# EAGLE design Buttons (EAGLE 9.6.2)
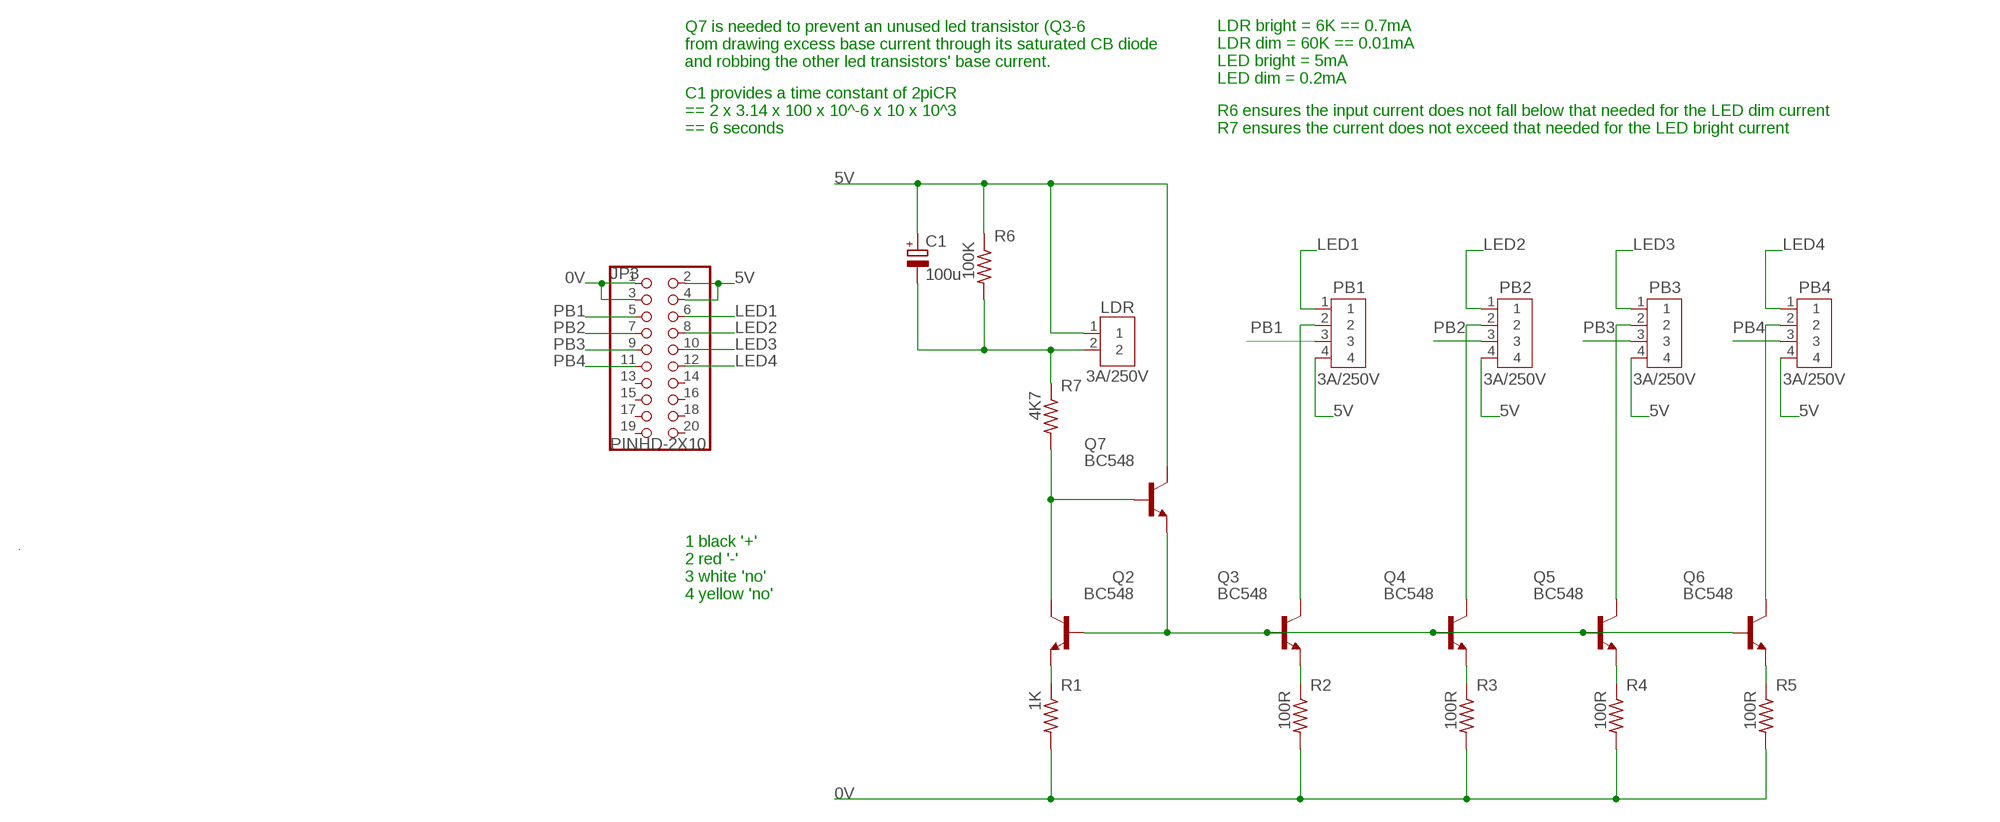
[diagram p0: schematic, sheet 1]

## Parts
C1  100u  CPOL-EUE3.5-8  [E3,5-8]
JP3  PINHD-2X10  [2X10]
LDR  3A/250V  B2B-XH-A  [B2B-XH-A]
PB1  3A/250V  B4B-XH-A  [B4B-XH-A]
PB2  3A/250V  B4B-XH-A  [B4B-XH-A]
PB3  3A/250V  B4B-XH-A  [B4B-XH-A]
PB4  3A/250V  B4B-XH-A  [B4B-XH-A]
Q2  BC548  [TO92-EBC]
Q3  BC548  [TO92-EBC]
Q4  BC548  [TO92-EBC]
Q5  BC548  [TO92-EBC]
Q6  BC548  [TO92-EBC]
Q7  BC548  [TO92-EBC]
R1  1K  RES_7  [0204/7]
R2  100R  RES_7  [0204/7]
R3  100R  RES_7  [0204/7]
R4  100R  RES_7  [0204/7]
R5  100R  RES_7  [0204/7]
R6  100K  RES_7  [0204/7]
R7  4K7  RES_7  [0204/7]

## Nets
0V: JP3.1 JP3.3 R1.2 R2.2 R3.2 R4.2 R5.2
5V: C1.+ JP3.2 JP3.4 LDR.1 PB1.4 PB2.4 PB3.4 PB4.4 Q7.C R6.1
LED1: JP3.6 PB1.1
LED2: JP3.8 PB2.1
LED3: JP3.10 PB3.1
LED4: JP3.12 PB4.1
N$1: Q2.B Q3.B Q4.B Q5.B Q6.B Q7.E
N$2: C1.- LDR.2 R6.2 R7.1
N$3: Q2.C Q7.B R7.2
N$8: Q2.E R1.1
N$9: Q3.E R2.1
N$12: Q4.E R3.1
N$14: Q5.E R4.1
N$17: Q6.E R5.1
N$18: PB1.2 Q3.C
N$20: PB2.2 Q4.C
N$21: PB3.2 Q5.C
N$22: PB4.2 Q6.C
PB1: JP3.5 PB1.3
PB2: JP3.7 PB2.3
PB3: JP3.9 PB3.3
PB4: JP3.11 PB4.3
Unconnected: JP3.13 JP3.14 JP3.15 JP3.16 JP3.17 JP3.18 JP3.19 JP3.20

## Notes on the sheet
- Q7 is needed to prevent an unused led transistor (Q3-6
  from drawing excess base current through its saturated CB diode
  and robbing the other led transistors' base current.
- LDR bright = 6K == 0.7mA
  LDR dim = 60K == 0.01mA
  LED bright = 5mA
  LED dim = 0.2mA
- C1 provides a time constant of 2piCR
  == 2 x 3.14 x 100 x 10^-6 x 10 x 10^3
  == 6 seconds
- R6 ensures the input current does not fall below that needed for the LED dim current
  R7 ensures the current does not exceed that needed for the LED bright current
- 1 black '+'
  2 red '-'
  3 white 'no'
  4 yellow 'no'

## Library data of the parts
C1 = andrew-boyson:CPOL-EU: POLARIZED CAPACITOR, European symbol; SPICEPREFIX: C
JP3 = Connector:PINHD-2X10: PIN HEADER; CATEGORY: CONNECTOR; SUB-CATEGORY: PIN-HEADER
LDR = andrew-boyson:B2B-XH-A: XH Connector Top Entry - 2POS Details see: Datasheet <http://www.jst-mfg.com/product/pdf/eng/eXH.pdf>; CATEGORY: CONNECTOR; DESCRIPTION: 2.5mm pitch/disconnectable crimp style connector; MANUFACTURER: JST (XH CONNECTOR); MPN: B2B-XH-A; OPERATING_TEMPERATURE: -25°C ~ 85°C; PART_STATUS: ACTIVE; ROHS_COMPLIANT: COMPLIANT; SERIES: B_B-XH-A; SUB_CATEGORY: Through hole connector; TYPE: top entry
PB1-PB4 = andrew-boyson:B4B-XH-A: XH Connector Top Entry - 4POS Details see: Datasheet <http://www.jst-mfg.com/product/pdf/eng/eXH.pdf>; CATEGORY: CONNECTOR; DSECRIPTION: 2.5mm pitch/disconnctable crimp style connector; MANUFACTURER: JST (XH connector); MPN: B4B-XH-A; OPERATING_TEMPERATURE: -25 C to 85 C; PART_STATUS: ACTIVE; ROHS_COMPLIANT: COMPLAINT; SERIES: B4B-XH-A; SUB_CATEGORY: Through hole; TYPE: TOP ENTRY
Q2-Q7 = transistor-npn:BC548*: NPN Transistor
R1-R7 = andrew-boyson:RES_7: RESISTOR, American symbol

## Board
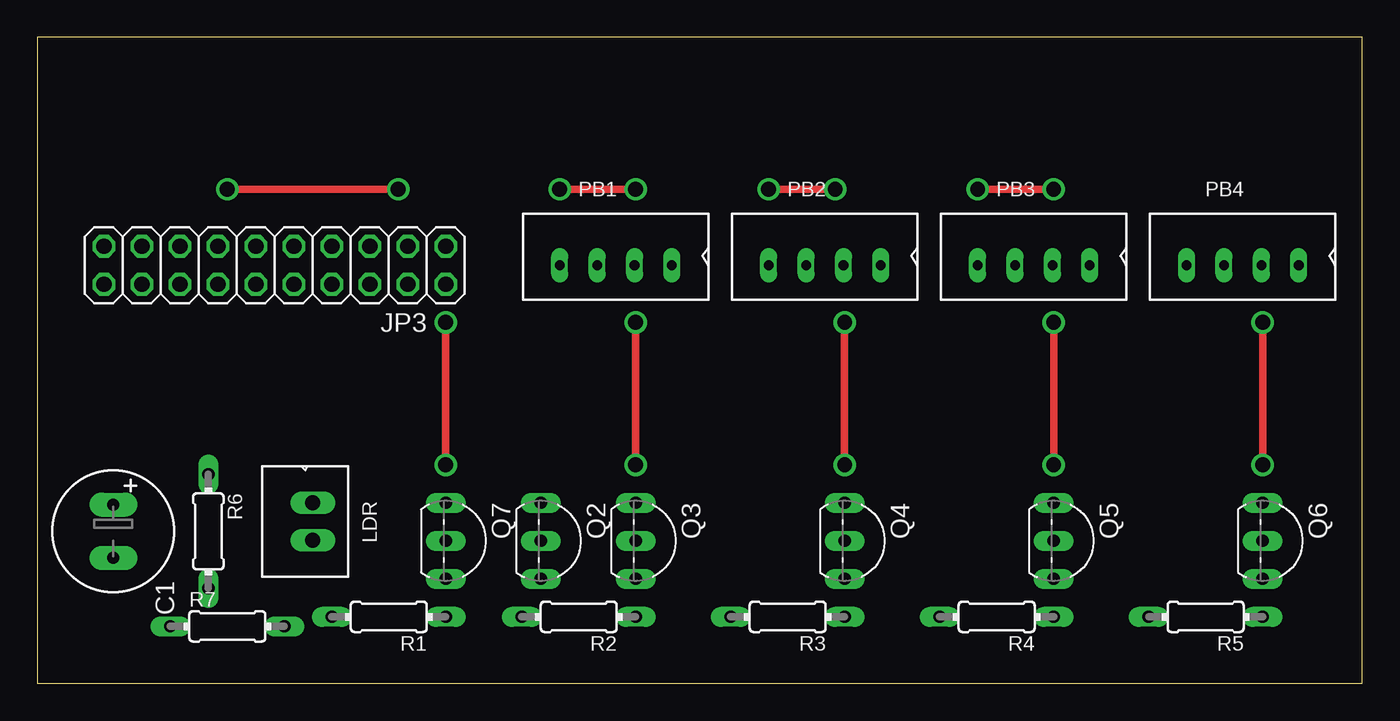
[diagram p1: board, top side]
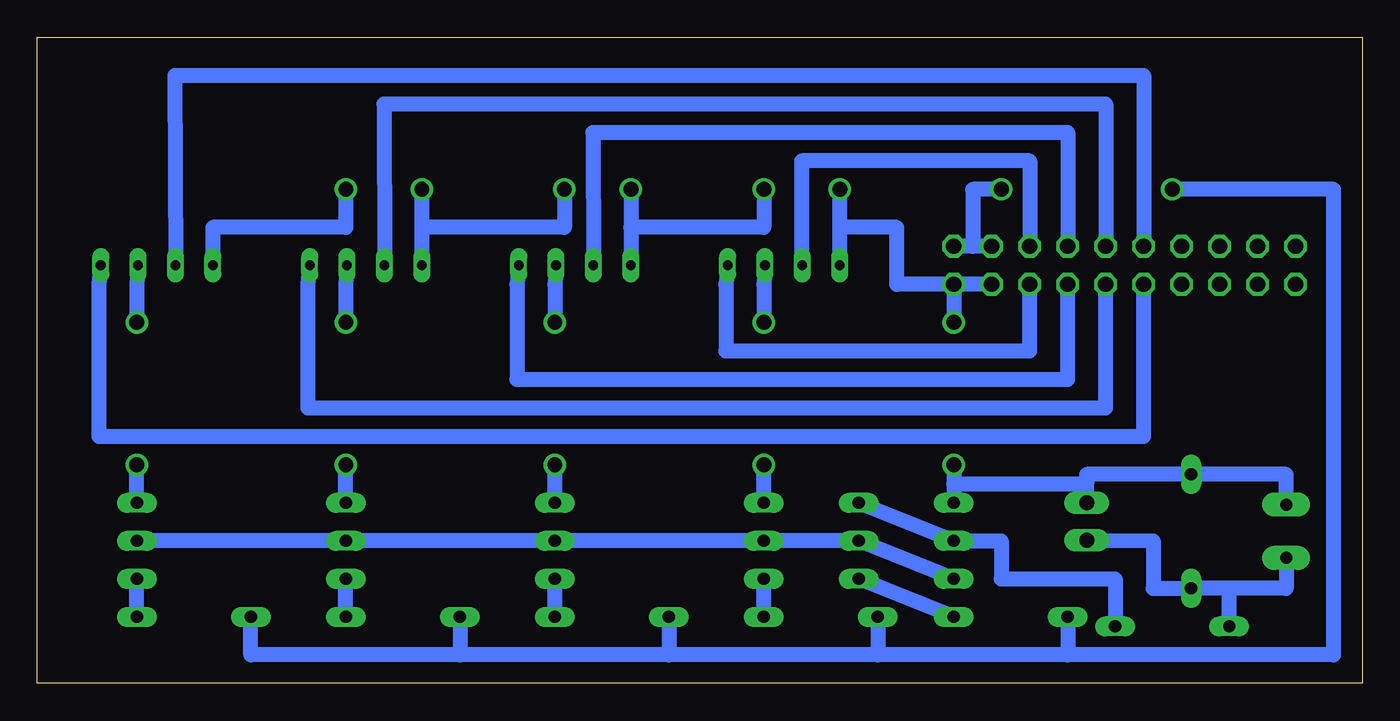
[diagram p2: board, bottom side, seen from below]

Size 88.57 x 43.17 mm. Coordinates in mm from the lower left corner, seen from the top.
Outline: 0,0 88.57,0 88.57,43.17 0,43.17 0,0
Copper layers (1*16): Top 0.035mm / dielectric 1.5mm / Bottom 0.035mm
Design rules "default": minimum track width 6mil, minimum drill 0.35mm, track to track 6mil, track to pad 6mil, pad to pad 6mil, via to via 6mil, smd to smd 6mil, copper to edge 40mil, drill to drill 6mil, minimum pad ring 10mil, minimum via ring 8mil, stop-mask expansion 4mil, vias tented up to drill 0mil, thermal gap 10mil

### Footprints (pad centres in the part's own frame; a part is rotated, then mirrored left to right if it is on the bottom)
E3,5-8 = drill 0.813 pad 1.6 long: + -1.778,0; - 1.778,0
2X10 = drill 1.016 octagon: 1 -11.43,-1.27; 2 -11.43,1.27; 3 -8.89,-1.27; 4 -8.89,1.27; 5 -6.35,-1.27; 6 -6.35,1.27; 7 -3.81,-1.27; 8 -3.81,1.27; 9 -1.27,-1.27; 10 -1.27,1.27; 11 1.27,-1.27; 12 1.27,1.27; 13 3.81,-1.27; 14 3.81,1.27; 15 6.35,-1.27; 16 6.35,1.27; 17 8.89,-1.27; 18 8.89,1.27; 19 11.43,-1.27; 20 11.43,1.27
B2B-XH-A = drill 1 long: 1 0,0; 2 2.5,0
B4B-XH-A = drill 0.64 long: 1 7.5,0; 2 5,0; 3 2.5,0; 4 0,0
TO92-EBC = drill 0.813 long: B 0,-1.27; C -2.54,-1.27; E 2.54,-1.27
0204/7 = drill 0.813 long: 1 -3.81,0; 2 3.81,0

### Placement (x,y rotation side)
C1  5.08,10.16 270 top
JP3  15.88,27.94 180 top
LDR  18.41,12.06 270 top
PB1  34.92,27.94 0 top
PB2  48.9,27.94 0 top
PB3  62.87,27.94 0 top
PB4  76.83,27.94 0 top
Q2  34.92,9.53 270 top
Q3  41.27,9.53 270 top
Q4  55.24,9.53 270 top
Q5  69.22,9.53 270 top
Q6  83.19,9.53 270 top
Q7  28.57,9.53 270 top
R1  23.5,4.45 180 top
R2  36.2,4.45 180 top
R3  50.16,4.45 180 top
R4  64.14,4.45 180 top
R5  78.11,4.45 180 top
R6  11.43,10.16 270 top
R7  12.7,3.81 0 top

### Tracks (layer width: path | path; a pad name or v marks a point on that pad's centre or on a via)
0V  (via drill 1)
  Top 0.508: v24.13,33.02 v12.7,33.02
  Bottom 1.016: JP3.3 26.04,29.21 | 26.04,29.21 JP3.1 | v12.7,33.02 1.91,33.02 1.91,1.91 19.68,1.91 | 19.68,1.91 32.38,1.91 | 32.38,1.91 46.35,1.91 | 46.35,1.91 60.33,1.91 | 60.33,1.91 74.3,1.91 R5.2 | R4.2 60.33,1.91 | R3.2 46.35,1.91 | R2.2 32.38,1.91 | R1.2 19.68,1.91 | v24.13,33.02 26.04,33.02 26.04,29.21
5V  (via drill 1)
  Top 0.508: v27.3,24.13 v27.3,14.61 | v34.92,33.02 v40.01,33.02 | v48.9,33.02 v53.34,33.02 | v62.87,33.02 v67.94,33.02
  Bottom 1.016: JP3.4 JP3.2 | v27.3,14.61 27.3,13.34 | 27.3,13.34 Q7.C | LDR.1 18.41,13.34 | JP3.2 v27.3,24.13 | PB1.4 34.92,30.48 | 34.92,30.48 v34.92,33.02 | PB3.4 62.87,30.48 | 62.87,30.48 v62.87,33.02 | 27.3,13.34 18.41,13.34 | JP3.2 31.11,26.67 31.11,30.48 34.92,30.48 | v40.01,33.02 40.01,30.48 48.9,30.48 | 48.9,30.48 PB2.4 | v48.9,33.02 48.9,30.48 | v53.34,33.02 53.34,30.48 62.87,30.48 | v67.94,33.02 67.94,30.48 76.83,30.48 PB4.4 | C1.+ 5.08,13.97 R6.1 18.41,13.97 18.41,13.34
LED1
  Bottom 1.016: PB1.1 42.55,26.67 42.55,22.23 22.23,22.23 JP3.6
LED2
  Bottom 1.016: PB2.1 56.52,26.67 56.52,20.32 19.68,20.32 JP3.8
LED3
  Bottom 1.016: PB3.1 70.48,26.67 70.48,18.41 17.14,18.41 JP3.10
LED4
  Bottom 1.016: PB4.1 84.45,26.67 84.45,16.51 14.61,16.51 JP3.12
N$1
  Bottom 1.016: Q7.E Q2.B Q3.B Q4.B Q5.B Q6.B
N$2
  Bottom 1.016: C1.- 5.08,6.35 8.89,6.35 | 8.89,6.35 R6.2 13.97,6.35 13.97,9.53 LDR.2 | R7.1 8.89,6.35
N$3
  Bottom 1.016: Q2.C Q7.B 24.13,9.53 24.13,6.99 16.51,6.99 R7.2
N$8
  Bottom 1.016: R1.1 Q2.E
N$9
  Bottom 1.016: R2.1 Q3.E
N$12
  Bottom 1.016: R3.1 Q4.E
N$14
  Bottom 1.016: R4.1 Q5.E
N$17
  Bottom 1.016: R5.1 Q6.E
N$18  (via drill 1)
  Top 0.508: v40.01,24.13 v40.01,14.61
  Bottom 1.016: Q3.C v40.01,14.61 | PB1.2 40.01,26.67 v40.01,24.13
N$20  (via drill 1)
  Top 0.508: v53.98,24.13 v53.98,14.61
  Bottom 1.016: Q4.C v53.98,14.61 | PB2.2 53.98,26.67 v53.98,24.13
N$21  (via drill 1)
  Top 0.508: v67.94,24.13 v67.94,14.61
  Bottom 1.016: Q5.C v67.94,14.61 | PB3.2 67.94,26.67 v67.94,24.13
N$22  (via drill 1)
  Top 0.508: v81.92,24.13 v81.92,14.61
  Bottom 1.016: Q6.C v81.92,14.61 | PB4.2 81.92,26.67 v81.92,24.13
PB1
  Bottom 1.016: JP3.5 22.23,34.92 37.47,34.92 37.47,29.21 PB1.3
PB2
  Bottom 1.016: PB2.3 51.44,36.83 19.68,36.83 JP3.7
PB3
  Bottom 1.016: PB3.3 65.41,38.73 17.14,38.73 JP3.9
PB4
  Bottom 1.016: PB4.3 79.38,40.64 14.61,40.64 JP3.11